# EAGLE design hexapod (EAGLE 5.91)
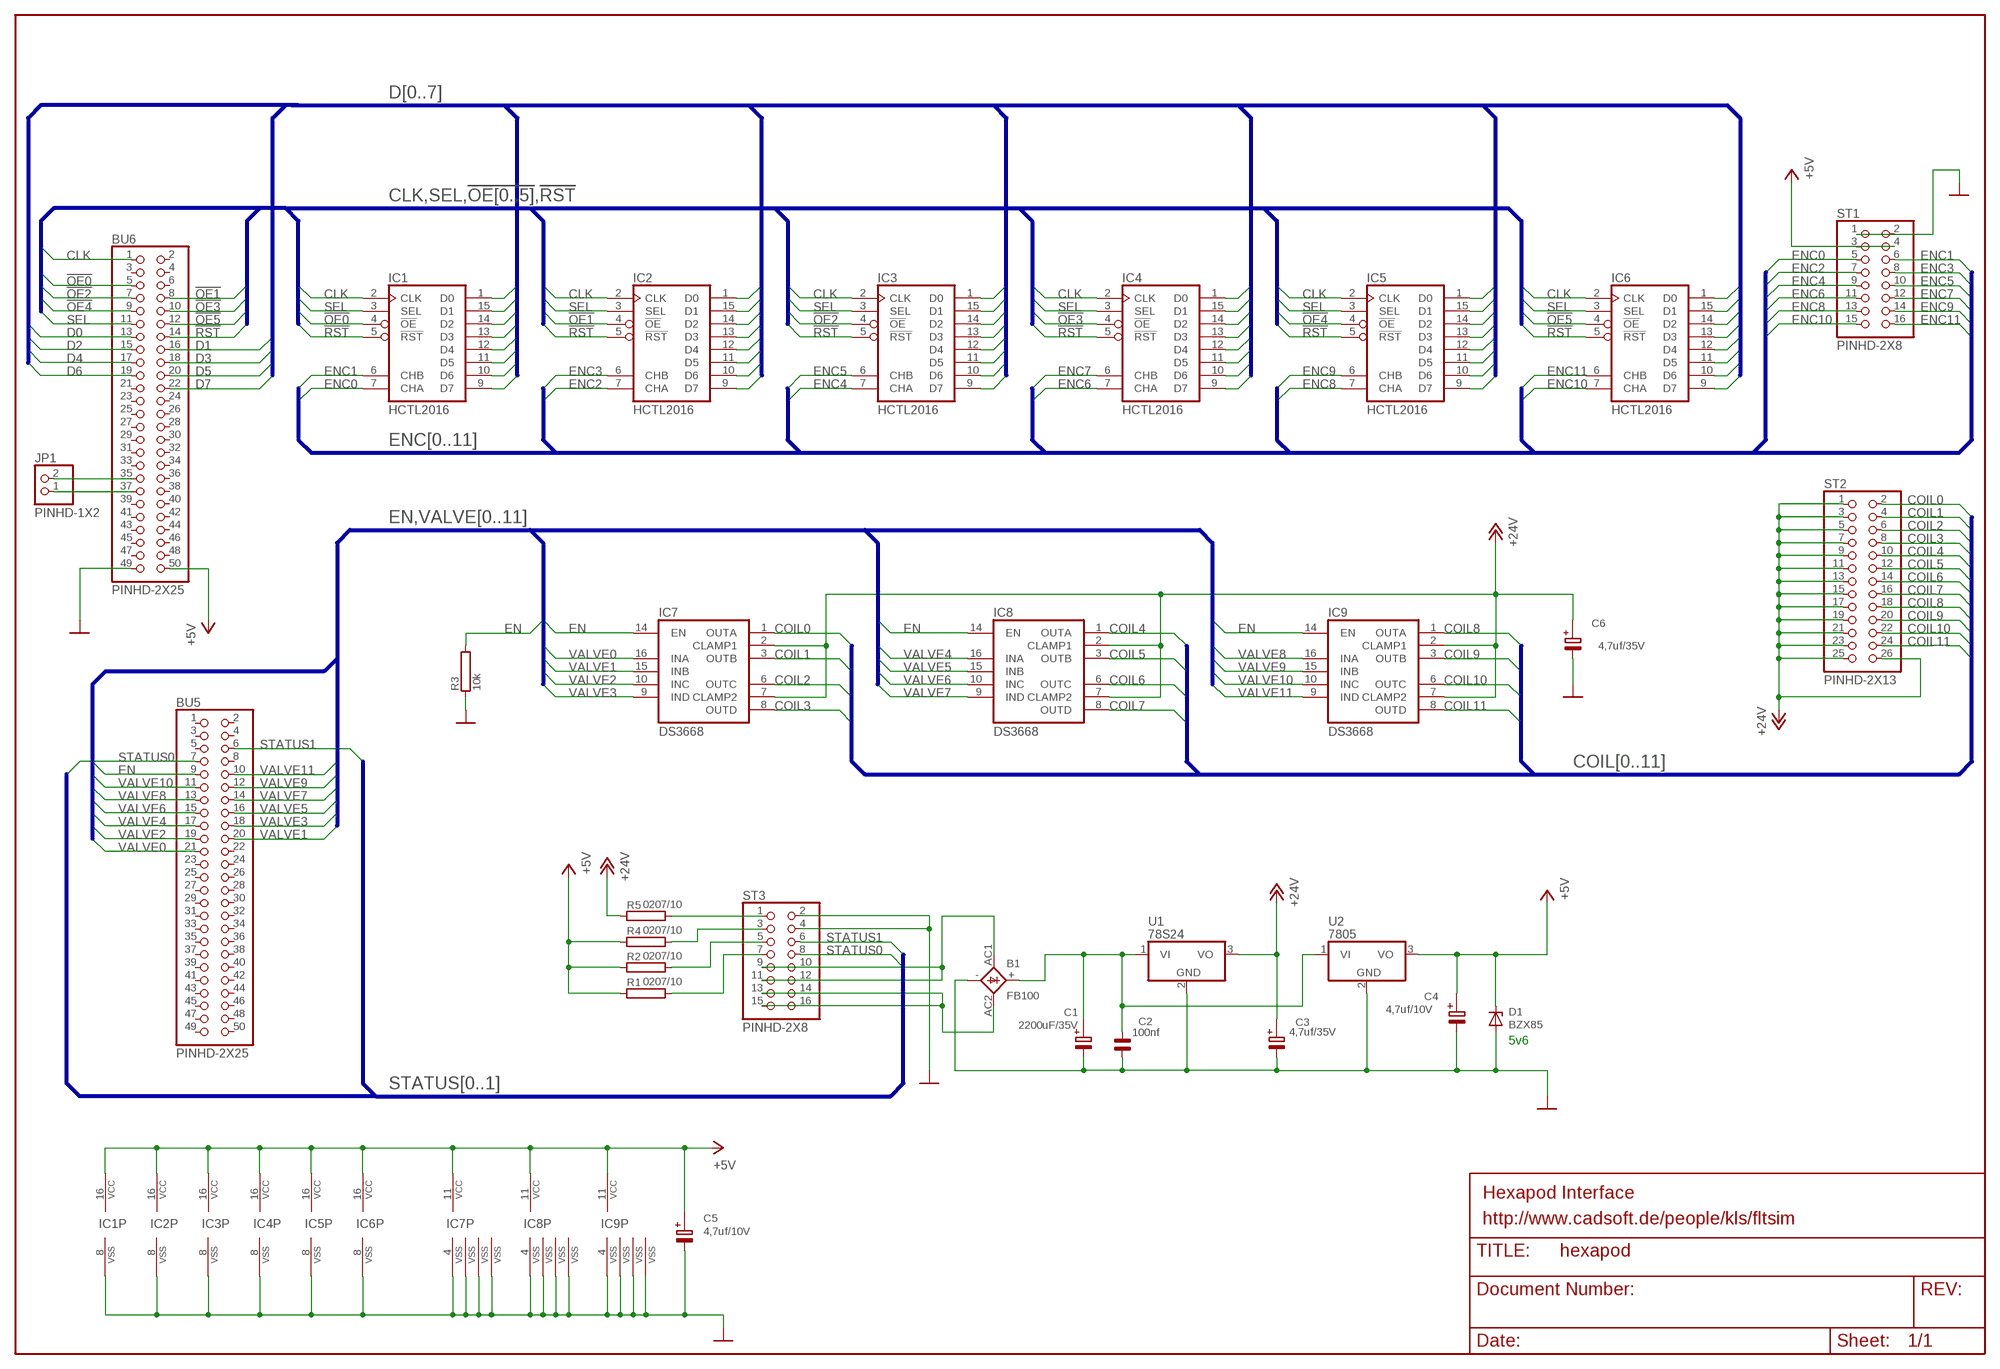
[diagram p0: schematic, sheet 1]

## Parts
B1  FB100  [FB100]
BU5  PINHD-2X25  [2X25]
BU6  PINHD-2X25  [2X25]
C1  2200uF/35V  E35-16  [E35-16]
C2  100nf  C5B2,5A  [C5B2,5A]
C3  4,7uf/35V  E2-5@1  [E2,5-5]
C4  4,7uf/10V  E2,5-5  [E2,5-5]
C5  4,7uf/10V  E2,5-5  [E2,5-5]
C6  4,7uf/35V  E2-5@1  [E2,5-5]
D1  BZX85  [DO41Z10]
IC1  HCTL2016  [DIL-16]
IC2  HCTL2016  [DIL-16]
IC3  HCTL2016  [DIL-16]
IC4  HCTL2016  [DIL-16]
IC5  HCTL2016  [DIL-16]
IC6  HCTL2016  [DIL-16]
IC7  DS3668  [DIL-16]
IC8  DS3668  [DIL-16]
IC9  DS3668  [DIL-16]
JP1  PINHD-1X2  [1X02]
R1  0207/10  [0207/10]
R2  0207/10  [0207/10]
R3  10k  0207/10@1  [0207/10@1]
R4  0207/10  [0207/10]
R5  0207/10  [0207/10]
ST1  PINHD-2X8  PINHD-2X8@1  [ML16]
ST2  PINHD-2X13  PINHD-2X13@1  [ML26]
ST3  PINHD-2X8  PINHD-2X8@1  [ML16]
U1  78S24  78XXT  [TO220H]
U2  7805  78XXT  [TO220H]

## Nets
!OE0: BU6.5 IC1.4(!OE)
!OE1: BU6.8 IC2.4(!OE)
!OE2: BU6.7 IC3.4(!OE)
!OE3: BU6.10 IC4.4(!OE)
!OE4: BU6.9 IC5.4(!OE)
!OE5: BU6.12 IC6.4(!OE)
!RST: BU6.14 IC1.5(!RST) IC2.5(!RST) IC3.5(!RST) IC4.5(!RST) IC5.5(!RST) IC6.5(!RST)
+5V [supply]: BU6.50 C4.+ C5.+ D1.K IC1.16(VCC) IC2.16(VCC) IC3.16(VCC) IC4.16(VCC) IC5.16(VCC) IC6.16(VCC) IC7.11(VCC) IC8.11(VCC) IC9.11(VCC) R1.1 R2.1 R4.1 ST1.3 ST1.4 U2.3(VO)
+24V [supply]: C3.+ C6.+ IC7.2(CLAMP1) IC7.7(CLAMP2) IC8.2(CLAMP1) IC8.7(CLAMP2) IC9.2(CLAMP1) IC9.7(CLAMP2) R5.1 ST2.1 ST2.3 ST2.5 ST2.7 ST2.9 ST2.11 ST2.13 ST2.15 ST2.17 ST2.19 ST2.21 ST2.23 ST2.25 ST2.26 U1.3(VO)
AC1 [supply]: B1.AC1 ST3.9 ST3.10 ST3.11 ST3.12
AC2 [supply]: B1.AC2 ST3.13 ST3.14 ST3.15 ST3.16
CLK: BU6.1 IC1.2(CLK) IC2.2(CLK) IC3.2(CLK) IC4.2(CLK) IC5.2(CLK) IC6.2(CLK)
COIL0: IC7.1(OUTA) ST2.2
COIL1: IC7.3(OUTB) ST2.4
COIL2: IC7.6(OUTC) ST2.6
COIL3: IC7.8(OUTD) ST2.8
COIL4: IC8.1(OUTA) ST2.10
COIL5: IC8.3(OUTB) ST2.12
COIL6: IC8.6(OUTC) ST2.14
COIL7: IC8.8(OUTD) ST2.16
COIL8: IC9.1(OUTA) ST2.18
COIL9: IC9.3(OUTB) ST2.20
COIL10: IC9.6(OUTC) ST2.22
COIL11: IC9.8(OUTD) ST2.24
D0: BU6.13 IC1.1(D0) IC2.1(D0) IC3.1(D0) IC4.1(D0) IC5.1(D0) IC6.1(D0)
D1: BU6.16 IC1.15(D1) IC2.15(D1) IC3.15(D1) IC4.15(D1) IC5.15(D1) IC6.15(D1)
D2: BU6.15 IC1.14(D2) IC2.14(D2) IC3.14(D2) IC4.14(D2) IC5.14(D2) IC6.14(D2)
D3: BU6.18 IC1.13(D3) IC2.13(D3) IC3.13(D3) IC4.13(D3) IC5.13(D3) IC6.13(D3)
D4: BU6.17 IC1.12(D4) IC2.12(D4) IC3.12(D4) IC4.12(D4) IC5.12(D4) IC6.12(D4)
D5: BU6.20 IC1.11(D5) IC2.11(D5) IC3.11(D5) IC4.11(D5) IC5.11(D5) IC6.11(D5)
D6: BU6.19 IC1.10(D6) IC2.10(D6) IC3.10(D6) IC4.10(D6) IC5.10(D6) IC6.10(D6)
D7: BU6.22 IC1.9(D7) IC2.9(D7) IC3.9(D7) IC4.9(D7) IC5.9(D7) IC6.9(D7)
EN: BU5.9 IC7.14(EN) IC8.14(EN) IC9.14(EN) R3.2
ENC0: IC1.7(CHA) ST1.5
ENC1: IC1.6(CHB) ST1.6
ENC2: IC2.7(CHA) ST1.7
ENC3: IC2.6(CHB) ST1.8
ENC4: IC3.7(CHA) ST1.9
ENC5: IC3.6(CHB) ST1.10
ENC6: IC4.7(CHA) ST1.11
ENC7: IC4.6(CHB) ST1.12
ENC8: IC5.7(CHA) ST1.13
ENC9: IC5.6(CHB) ST1.14
ENC10: IC6.7(CHA) ST1.15
ENC11: IC6.6(CHB) ST1.16
GND [supply]: B1.- BU6.49 C1.- C2.1 C3.- C4.- C5.- C6.- D1.A IC1.8(VSS) IC2.8(VSS) IC3.8(VSS) IC4.8(VSS) IC5.8(VSS) IC6.8(VSS) IC7.4(VSS) IC7.5(VSS) IC7.12(VSS) IC7.13(VSS) IC8.4(VSS) IC8.5(VSS) IC8.12(VSS) IC8.13(VSS) IC9.4(VSS) IC9.5(VSS) IC9.12(VSS) IC9.13(VSS) R3.1 ST1.1 ST1.2 ST3.2 ST3.4 U1.2(GND) U2.2(GND)
N$4: R5.2 ST3.1
N$5: R4.2 ST3.3
N$6: R2.2 ST3.5
N$7: R1.2 ST3.7
N$8: BU6.35 JP1.2
N$9: BU6.37 JP1.1
SEL: BU6.11 IC1.3(SEL) IC2.3(SEL) IC3.3(SEL) IC4.3(SEL) IC5.3(SEL) IC6.3(SEL)
STATUS0: BU5.7 ST3.8
STATUS1: BU5.6 ST3.6
VALVE0: BU5.21 IC7.16(INA)
VALVE1: BU5.20 IC7.15(INB)
VALVE2: BU5.19 IC7.10(INC)
VALVE3: BU5.18 IC7.9(IND)
VALVE4: BU5.17 IC8.16(INA)
VALVE5: BU5.16 IC8.15(INB)
VALVE6: BU5.15 IC8.10(INC)
VALVE7: BU5.14 IC8.9(IND)
VALVE8: BU5.13 IC9.16(INA)
VALVE9: BU5.12 IC9.15(INB)
VALVE10: BU5.11 IC9.10(INC)
VALVE11: BU5.10 IC9.9(IND)
VIN [supply]: B1.+ C1.+ C2.2 U1.1(VI) U2.1(VI)
Unconnected: BU5.1 BU5.2 BU5.3 BU5.4 BU5.5 BU5.8 BU5.22 BU5.23 BU5.24 BU5.25 BU5.26 BU5.27 BU5.28 BU5.29 BU5.30 BU5.31 BU5.32 BU5.33 BU5.34 BU5.35 BU5.36 BU5.37 BU5.38 BU5.39 BU5.40 BU5.41 BU5.42 BU5.43 BU5.44 BU5.45 BU5.46 BU5.47 BU5.48 BU5.49 BU5.50 BU6.2 BU6.3 BU6.4 BU6.6 BU6.21 BU6.23 BU6.24 BU6.25 BU6.26 BU6.27 BU6.28 BU6.29 BU6.30 BU6.31 BU6.32 BU6.33 BU6.34 BU6.36 BU6.38 BU6.39 BU6.40 BU6.41 BU6.42 BU6.43 BU6.44 BU6.45 BU6.46 BU6.47 BU6.48

## Buses
D[0..7]
CLK,SEL,!OE[0..5],!RST
ENC[0..11]
EN,VALVE[0..11]
COIL[0..11]
STATUS[0..1]

## Notes on the sheet
- 5v6
- Hexapod Interface
- http://www.cadsoft.de/people/kls/fltsim

## Library data of the parts
B1 = RECTIF:FB100
BU5 BU6 = PINHEAD:PINHD-2X25
C1 = ELKO:E35-16
C2 = CAP-WI:C5B2,5A
C3 C6 = ELKO:E2-5@1
C4 C5 = ELKO:E2,5-5
D1 = diode:BZX85
IC1-IC6 = klaus:HCTL2016
IC7-IC9 = klaus:DS3668
JP1 = PINHEAD:PINHD-1X2
R1 R2 R4 R5 = R:0207/10
R3 = R:0207/10@1
ST1 ST3 = PINHEAD:PINHD-2X8@1
ST2 = PINHEAD:PINHD-2X13@1
U1 U2 = LINEAR:78XXT

## Net classes
0 default: width 0.406 mm
1 supply: width 1.143 mm

## Board
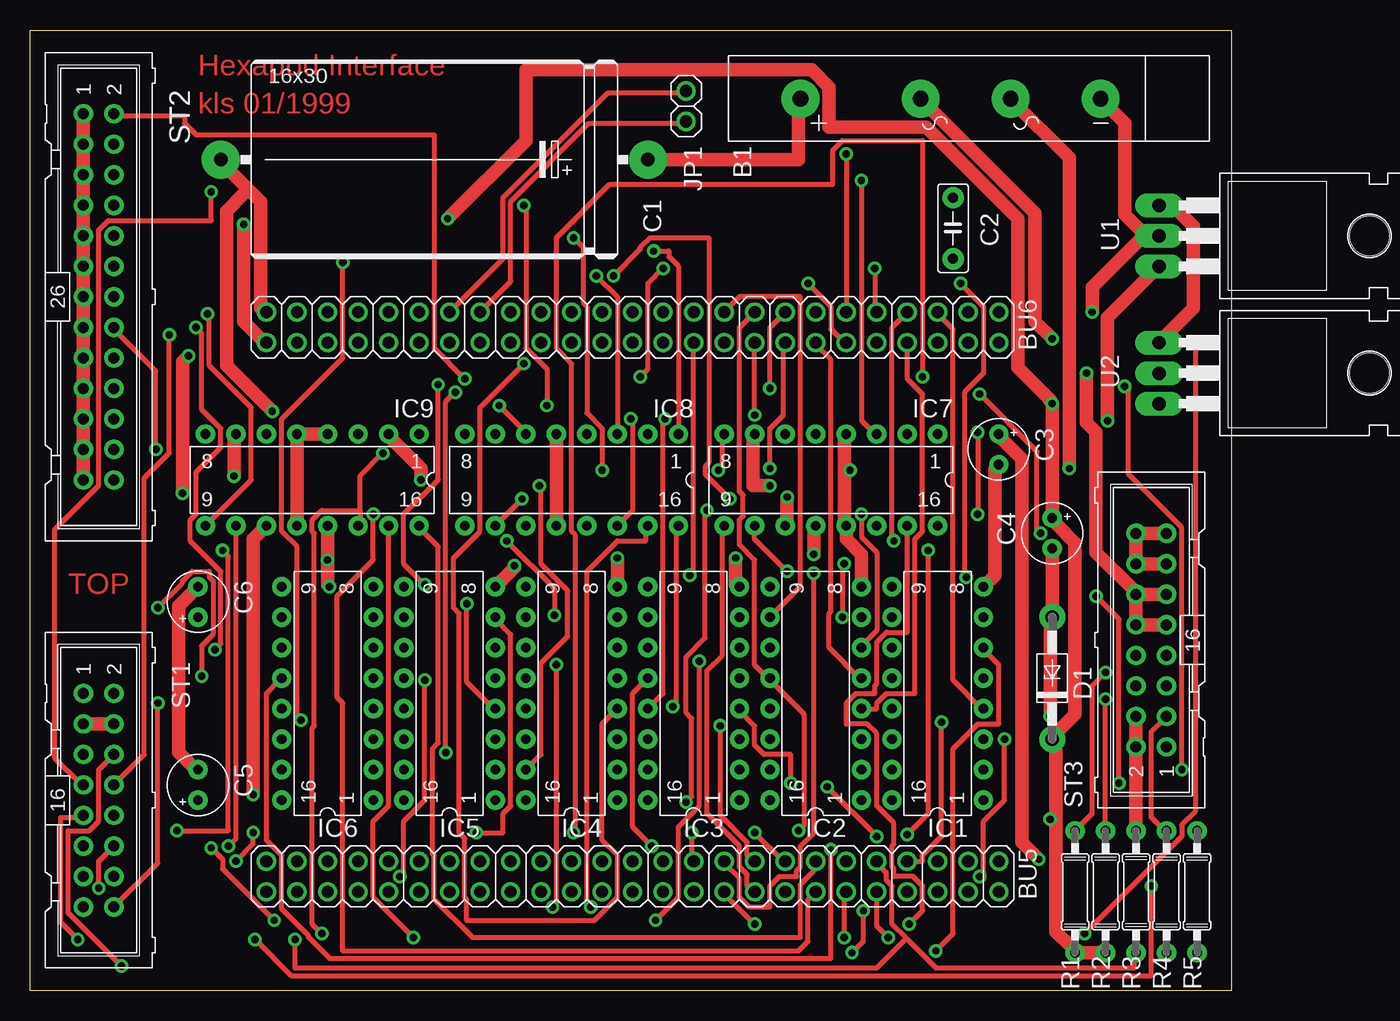
[diagram p1: board, top side]
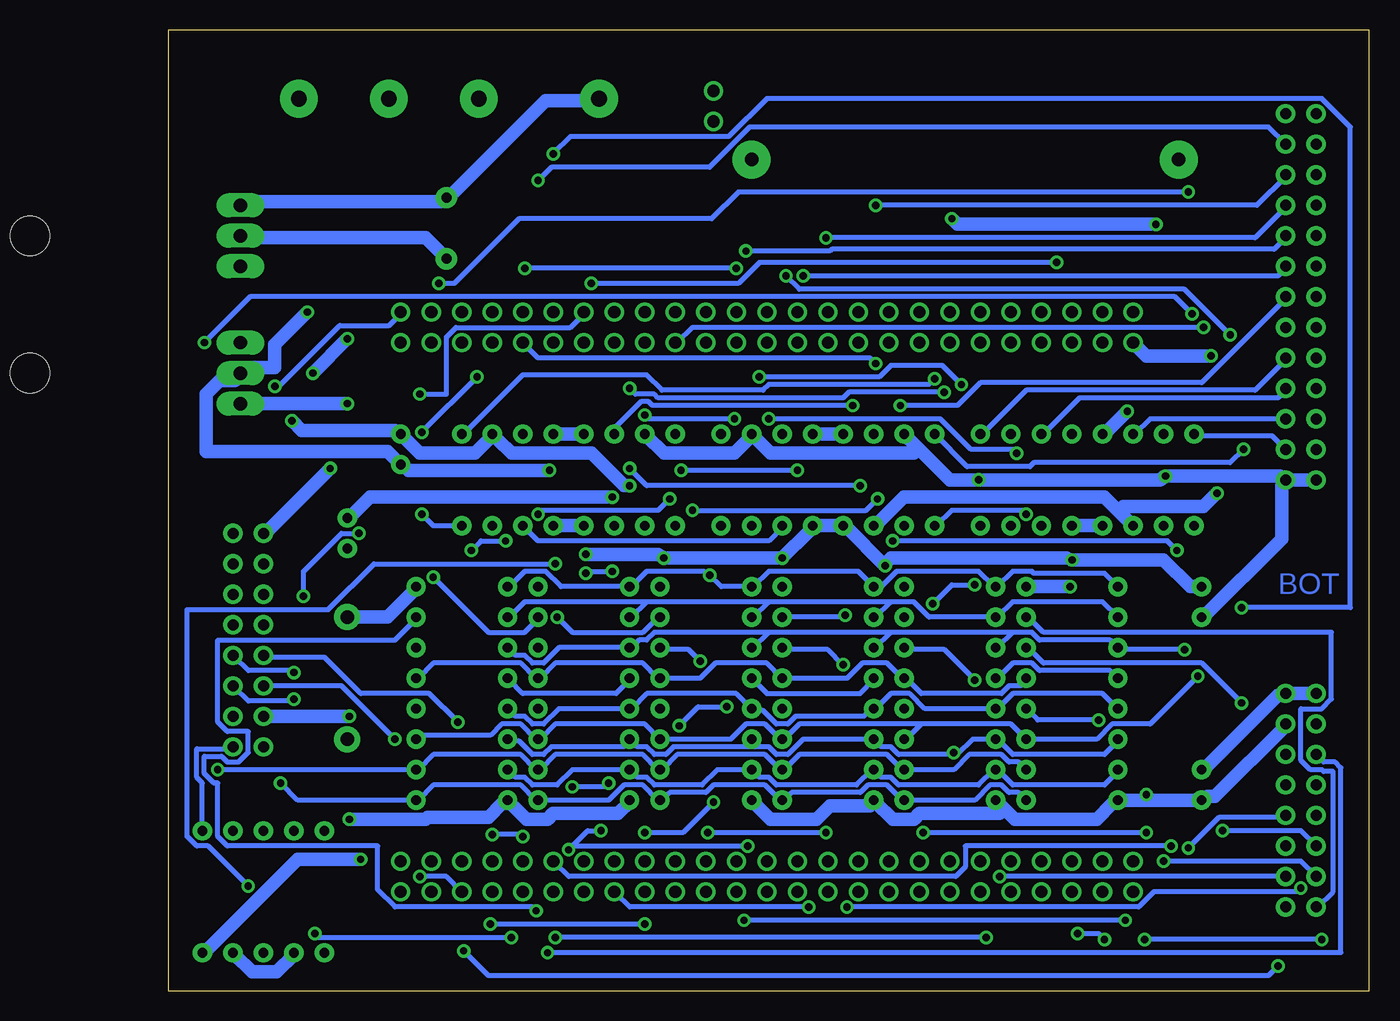
[diagram p2: board, bottom side, seen from below]

Size 100 x 80 mm. Coordinates in mm from the lower left corner, seen from the top.
Outline: 0,0 0,80 100,80 100,0 0,0
Copper layers (1*16): Top 0.035mm / dielectric 1.5mm / Bottom 0.035mm
Design rules: minimum track width 10mil, minimum drill 24mil, track to track 8mil, track to pad 8mil, pad to pad 8mil, via to via 8mil, smd to smd 8mil, copper to edge 40mil, drill to drill 8mil, minimum pad ring 10mil, minimum via ring 10mil, stop-mask expansion 0mil, vias tented up to drill 0mil, thermal gap 10mil

### Footprints (pad centres in the part's own frame; a part is rotated, then mirrored left to right if it is on the bottom)
FB100 = drill 1.321 pad 3.15: + 0,0; - 24.994,0; AC1 10.008,0; AC2 17.501,0
2X25 = drill 1.016 pad 1.6: 1 -30.48,-1.27; 2 -30.48,1.27; 3 -27.94,-1.27; 4 -27.94,1.27; 5 -25.4,-1.27; 6 -25.4,1.27; 7 -22.86,-1.27; 8 -22.86,1.27; 9 -20.32,-1.27; 10 -20.32,1.27; 11 -17.78,-1.27; 12 -17.78,1.27; 13 -15.24,-1.27; 14 -15.24,1.27; 15 -12.7,-1.27; 16 -12.7,1.27; 17 -10.16,-1.27; 18 -10.16,1.27; 19 -7.62,-1.27; 20 -7.62,1.27; 21 -5.08,-1.27; 22 -5.08,1.27; 23 -2.54,-1.27; 24 -2.54,1.27; 25 0,-1.27; 26 0,1.27; 27 2.54,-1.27; 28 2.54,1.27; 29 5.08,-1.27; 30 5.08,1.27; 31 7.62,-1.27; 32 7.62,1.27; 33 10.16,-1.27; 34 10.16,1.27; 35 12.7,-1.27; 36 12.7,1.27; 37 15.24,-1.27; 38 15.24,1.27; 39 17.78,-1.27; 40 17.78,1.27; 41 20.32,-1.27; 42 20.32,1.27; 43 22.86,-1.27; 44 22.86,1.27; 45 25.4,-1.27; 46 25.4,1.27; 47 27.94,-1.27; 48 27.94,1.27; 49 30.48,-1.27; 50 30.48,1.27
E35-16 = drill 1.118 pad 3.15: + -17.78,0; - 17.78,0
C5B2,5A = drill 0.813 pad 1.778: 1 -2.54,0; 2 2.54,0
E2,5-5 = drill 0.813 pad 1.6: + -1.27,0; - 1.27,0
DO41Z10 = drill 1.118 pad 2.159: A 5.08,0; K -5.08,0
DIL-16 = drill 0.813 pad 1.6: 1 -8.89,-3.81; 2 -6.35,-3.81; 3 -3.81,-3.81; 4 -1.27,-3.81; 5 1.27,-3.81; 6 3.81,-3.81; 7 6.35,-3.81; 8 8.89,-3.81; 9 8.89,3.81; 10 6.35,3.81; 11 3.81,3.81; 12 1.27,3.81; 13 -1.27,3.81; 14 -3.81,3.81; 15 -6.35,3.81; 16 -8.89,3.81
1X02 = drill 1.016 pad 1.6: 1 -1.27,0; 2 1.27,0
0207/10 = drill 0.813 pad 1.6: 1 -5.08,0; 2 5.08,0
0207/10@1 = drill 0.813 pad 1.6: 1 -5.08,0; 2 5.08,0
ML16 = drill 0.914 pad 1.6: 1 -8.89,-1.27; 2 -8.89,1.27; 3 -6.35,-1.27; 4 -6.35,1.27; 5 -3.81,-1.27; 6 -3.81,1.27; 7 -1.27,-1.27; 8 -1.27,1.27; 9 1.27,-1.27; 10 1.27,1.27; 11 3.81,-1.27; 12 3.81,1.27; 13 6.35,-1.27; 14 6.35,1.27; 15 8.89,-1.27; 16 8.89,1.27
ML26 = drill 0.914 pad 1.6: 1 -15.24,-1.27; 2 -15.24,1.27; 3 -12.7,-1.27; 4 -12.7,1.27; 5 -10.16,-1.27; 6 -10.16,1.27; 7 -7.62,-1.27; 8 -7.62,1.27; 9 -5.08,-1.27; 10 -5.08,1.27; 11 -2.54,-1.27; 12 -2.54,1.27; 13 0,-1.27; 14 0,1.27; 15 2.54,-1.27; 16 2.54,1.27; 17 5.08,-1.27; 18 5.08,1.27; 19 7.62,-1.27; 20 7.62,1.27; 21 10.16,-1.27; 22 10.16,1.27; 23 12.7,-1.27; 24 12.7,1.27; 25 15.24,-1.27; 26 15.24,1.27
TO220H = drill 1.118 pad 2 long: 1 -2.54,-6.35; 2 0,-6.35; 3 2.54,-6.35 | hole 3.302: 0,11.176

### Placement (x,y rotation side)
B1  64.14,74.3 0 top
BU5  50.16,9.53 180 top
BU6  50.16,55.24 180 top
C1  33.66,69.22 180 top
C2  76.83,63.5 90 top
C3  80.64,45.09 270 top
C4  85.09,38.1 270 top
C5  13.97,17.14 90 top
C6  13.97,32.38 90 top
D1  85.09,26.04 90 top
IC1  75.56,24.77 90 top
IC2  65.41,24.77 90 top
IC3  55.24,24.77 90 top
IC4  45.09,24.77 90 top
IC5  34.92,24.77 90 top
IC6  24.77,24.77 90 top
IC7  66.67,42.55 180 top
IC8  45.09,42.55 180 top
IC9  23.5,42.55 180 top
JP1  54.61,73.66 270 top
R1  87,8.26 90 top
R2  89.53,8.26 90 top
R3  92.08,8.26 270 top
R4  94.61,8.26 90 top
R5  97.16,8.26 90 top
ST1  5.71,15.88 270 top
ST2  5.71,57.78 270 top
ST3  93.34,29.21 90 top
U1  100.33,62.87 270 top
U2  100.33,51.44 270 top

### Tracks (layer width: path | path; a pad name or v marks a point on that pad's centre or on a via)
!OE0
  Top 0.406: IC1.4 79.22,23.5 76.83,25.88 76.83,55.09 75.56,56.36 BU6.5
!OE1
  Top 0.406: IC2.4 70.48,23.5 70.48,23.97 71.28,24.77 73.66,24.77 73.66,37.62 74.3,38.26 74.3,49.69 73.03,50.96 BU6.8 | IC2.4
!OE2  (via drill 0.61)
  Top 0.406: v63.34,17.3 63.34,19.68 61.12,19.68 60.33,20.48 60.33,22.07 59.05,23.34 IC3.4 | v66.36,16.99 v70.48,12.86 | v73.03,13.02 74.77,14.76 v74.77,36.67 | v71.91,37.47 71.75,37.62 71.75,55.24 72.87,56.36 BU6.7
  Bottom 0.406: v63.34,17.3 63.66,16.99 v66.36,16.99 | v70.48,12.86 70.64,13.02 v73.03,13.02 | v74.77,36.67 73.98,37.47 v71.91,37.47
!OE3  (via drill 0.61)
  Top 0.406: v41.12,52.23 37.47,48.58 37.47,38.26 35.24,36.04 35.24,31.91 35.72,31.43 35.72,13.18 36.2,12.7 36.2,7.78 36.35,7.62 36.35,5.87 46.99,5.87 48.9,7.78 48.9,11.27 47.62,12.54 47.62,22.23 48.74,23.34 IC4.4
  Bottom 0.406: v41.12,52.23 41.59,52.7 69.22,52.7 70.33,53.82 BU6.10
!OE4  (via drill 0.61)
  Top 0.406: v36.35,32.23 36.35,25.72 38.58,23.5 IC5.4 | v32.86,33.81 31.11,35.56 31.11,39.69 33.97,42.55 v33.97,50.48 | v50.8,51.12 51.44,51.75 51.44,58.9 v52.7,60.17 | v70.33,60.17 70.33,56.52 BU6.9
  Bottom 0.406: v36.35,32.23 34.77,33.81 v32.86,33.81 | v33.97,50.48 35.56,52.07 39.85,52.07 40.8,51.12 v50.8,51.12 | v52.7,60.17 v70.33,60.17
!OE5  (via drill 0.61)
  Top 0.406: v22.54,22.54 22.23,22.86 22.23,36.99 20.95,38.26 20.95,47.62 26.04,52.7 v26.04,60.64 | v64.77,58.9 66.67,56.99 66.67,55.09 67.79,53.98 BU6.12
  Bottom 0.406: v22.54,22.54 27.62,22.54 28.42,23.34 IC6.4 | v26.04,60.64 50.8,60.64 52.55,58.9 v64.77,58.9
!RST
  Top 0.406: BU6.14 65.41,53.82 66.67,52.55 66.67,31.59 66.52,31.43 66.52,28.57 69.06,26.04 IC2.5
  Bottom 0.406: IC6.5 28.57,25.88 29.05,25.4 30,25.4 30.64,24.77 37.31,24.77 38.42,25.88 38.58,25.88 IC5.5 38.89,26.04 40.16,27.3 42.23,27.3 43.5,26.04 48.74,26.04 IC4.5 | IC4.5 50.16,27.3 54.45,27.3 55.72,26.04 58.9,26.04 IC3.5 59.21,26.04 60.48,27.3 67.79,27.3 69.06,26.04 IC2.5 69.37,26.04 70.64,27.3 77.95,27.3 79.22,26.04 IC1.5 | IC4.5
+5V  (via drill 0.61)
  Top 1.143: IC7.11 63.02,38.89 v63.02,41.12 | IC7.11 | C4.+ v85.09,48.9 84.77,49.37 82.23,51.91 82.23,64.29 74.61,71.91 66.52,71.91 66.52,75.25 65.09,76.68 41.27,76.68 41.27,70.8 v34.77,64.29 | C4.+ | R1.1 89.38,3.17 R2.1 | R1.1 | 85.41,14.29 85.41,4.92 86.68,3.65 R1.1 | 85.41,14.29 85.41,20.48 85.09,20.8 D1.K 85.41,21.43 87,23.02 87,37.31 85.41,38.89 C4.+ | 85.41,14.29 v84.93,14.29 | v13.18,52.86 12.7,52.39 v12.7,41.43 | ST1.3 6.83,22.23 ST1.4 | ST1.3 | v18.57,16.35 18.57,37.62 IC9.11 | v17.78,63.82 17.78,55.72 19.53,53.98 BU6.50
  Bottom 1.143: v63.02,41.12 83.19,41.12 84.93,39.37 C4.+ | v85.09,48.9 93.82,48.9 U2.3 | IC2.16 61.59,15.72 62.55,14.76 67.94,14.76 68.42,14.29 70.17,14.29 71.6,15.72 IC1.16 72.23,15.56 73.34,14.45 78.42,14.45 78.58,14.29 v84.93,14.29 | R4.1 94.46,3.02 93.03,1.59 90.96,1.59 89.53,3.02 R2.1 | 20.88,39.93 22.07,41.12 38.73,41.12 41.12,38.73 IC8.11 | IC9.11 20.88,39.93 | IC9.11 | v13.18,52.86 18.57,52.86 BU6.50 | v12.7,41.43 13.81,40.32 20.48,40.32 20.88,39.93 | 18.57,15.88 20.8,15.88 IC6.16 21.43,15.56 22.7,14.29 29.53,14.29 30.4,15.16 | C5.+ 18.57,15.88 | C5.+ | 30.4,15.16 IC5.16 | 30.4,15.16 30.8,14.76 37.47,14.76 37.94,14.29 39.69,14.29 41.12,15.72 IC4.16 41.59,15.4 44.93,15.4 46.04,14.29 49.85,14.29 51.28,15.72 IC3.16 | ST1.4 6.99,22.07 12.86,16.19 13.49,16.19 C5.+ | 18.57,15.88 v18.57,16.35 | v34.77,64.29 34.29,63.82 v17.78,63.82
+24V  (via drill 0.61)
  Top 1.143: v83.98,10.95 82.55,12.38 82.55,44.29 80.64,46.2 C3.+ | v89.69,47.47 89.69,56.04 U1.3 | v32.54,42.55 32.54,43.5 29.84,46.2 IC9.2 | ST2.25 | ST2.25 ST2.23 ST2.21 ST2.19 ST2.17 ST2.15 ST2.13 ST2.11 ST2.9 ST2.7 ST2.5 ST2.3 ST2.1 | v16.99,42.86 16.99,46.2 IC9.7 | v61.59,42.07 60.17,42.07 60.17,46.2 IC7.7
  Bottom 1.143: v83.98,10.95 89.22,10.95 97,3.17 R5.1 | v89.69,47.47 88.9,46.67 81.12,46.67 C3.+ 80.49,46.2 79.06,44.77 74.45,44.77 73.03,46.2 IC7.2 72.55,45.88 71.44,44.77 64.77,44.77 62.07,42.07 v61.59,42.07 | IC7.7 60.17,46.2 58.74,44.77 52.86,44.77 51.44,46.2 IC8.2 50.96,45.88 49.85,44.77 37.94,44.77 37.54,45.16 | 37.54,45.16 34.92,42.55 v32.54,42.55 17.46,42.55 v16.99,42.86 7.46,42.86 ST2.26 | 37.54,45.16 IC8.7 | ST2.25 6.83,42.55 ST2.26 | ST2.25 | C6.+ 13.81,31.11 7.3,37.62 7.3,42.07 ST2.26
AC1  (via drill 0.61)
  Top 1.143: ST3.10 | ST3.10 ST3.12 | ST3.9 94.46,30.48 92.55,30.48 ST3.10 | ST3.11 94.46,33.02 92.55,33.02 ST3.12 | v87.95,51.44 87.95,47.31 88.74,46.51 88.74,36.51 91.76,33.5 ST3.12 | v85.09,54.29 83.66,55.72 83.66,64.77 74.3,74.14 B1.AC1
  Bottom 1.143: v87.95,51.44 v85.09,54.29
AC2  (via drill 0.61)
  Top 1.143: ST3.14 | ST3.14 ST3.16 92.55,38.1 94.46,38.1 ST3.15 | ST3.13 94.46,35.56 92.55,35.56 ST3.14 | v86.52,43.5 86.52,69.37 81.76,74.14 B1.AC2
  Bottom 1.143: v86.52,43.5 91.92,38.1 ST3.16
CLK  (via drill 0.61)
  Top 0.406: v91.12,50.32 91.44,50.01 91.44,43.02 95.89,38.58 v95.89,18.41
  Bottom 0.406: IC6.2 29.21,19.05 30,19.05 30.64,19.68 33.34,19.68 34.61,18.41 38.58,18.41 IC5.2 38.89,18.41 40.16,19.68 47.47,19.68 48.74,18.41 IC4.2 49.05,18.41 50.32,19.68 57.63,19.68 58.9,18.41 IC3.2 59.21,18.41 60.48,19.68 67.79,19.68 69.06,18.41 IC2.2 69.37,18.41 70.64,19.68 77.95,19.68 79.22,18.41 IC1.2 79.53,18.41 v95.89,18.41 | IC6.2 | v91.12,50.32 90.81,50.32 85.72,55.4 81.6,55.4 80.64,56.36 BU6.1
COIL0  (via drill 0.61)
  Top 0.406: v36.2,50.96 33.66,53.5 33.66,71.28 13.81,71.28 12.86,72.23 12.86,72.87 6.99,72.87 ST2.2
  Bottom 0.406: v36.2,50.96 36.67,50.48 50.01,50.48 50.48,50.01 58.9,50.01 60.17,51.28 70.48,51.28 75.41,46.35 IC7.1
COIL1  (via drill 0.61)
  Top 0.406: v69.22,67.47 69.22,47.47 70.33,46.35 IC7.3
  Bottom 0.406: v69.22,67.47 68.1,68.58 54.93,68.58 51.59,71.91 8.41,71.91 ST2.4 | ST2.4
COIL2  (via drill 0.61)
  Top 0.406: v41.12,65.41 41.27,65.25 41.27,53.5 43.02,51.75 v43.02,48.74
  Bottom 0.406: v41.12,65.41 9.37,65.41 6.99,67.79 ST2.6 | v43.02,48.74 59.69,48.74 60.01,49.05 60.64,49.05 62.71,46.99 62.71,46.35 IC7.6
COIL3  (via drill 0.61)
  Top 0.406: v45.24,62.71 46.04,61.91 46.04,57.31 46.35,56.99 46.35,48.1 47.62,46.83 v47.62,43.34 | v57.31,43.34 57.63,43.66 57.63,46.2 IC7.8
  Bottom 0.406: v45.24,62.71 9.53,62.71 6.99,65.25 ST2.8 | v47.62,43.34 v57.31,43.34
COIL4  (via drill 0.61)
  Top 0.406: v51.91,61.59 53.18,61.59 53.18,61.12 53.98,60.33 IC8.1 | IC8.1
  Bottom 0.406: v51.91,61.59 44.93,61.59 44.77,61.75 7.94,61.75 6.99,62.71 ST2.10
COIL5  (via drill 0.61)
  Top 0.406: v47.15,59.53 48.9,57.78 IC8.3 | IC8.3
  Bottom 0.406: v47.15,59.53 7.62,59.53 6.99,60.17 ST2.12
COIL6  (via drill 0.61)
  Top 0.406: v39.05,48.74 41.12,46.67 41.12,46.35 IC8.6
  Bottom 0.406: v39.05,48.74 34.29,48.74 32.38,50.64 13.97,50.64 6.99,57.63 ST2.14
COIL7  (via drill 0.61)
  Top 0.406: v10.48,45.09 10.48,51.59 6.99,55.09 ST2.16
  Bottom 0.406: v10.48,45.09 11.59,43.97 27.94,43.97 28.26,43.66 33.5,43.66 IC8.8
COIL8
  Bottom 0.406: ST2.18 6.99,52.55 9.53,50.01 28.57,50.01 32.23,46.35 IC9.1
COIL9
  Bottom 0.406: ST2.20 6.99,50.01 7.62,49.37 24.13,49.37 27.15,46.35 IC9.3
COIL10
  Bottom 0.406: ST2.22 18.26,47.62 19.53,46.35 IC9.6 | ST2.22
COIL11
  Bottom 0.406: ST2.24 8.1,46.2 14.45,46.2 IC9.8 | ST2.24
D0  (via drill 0.61)
  Top 0.406: v79.06,49.69 83.82,44.93 83.82,38.42 v84.14,38.1 | v88.74,32.86 90.65,30.96 v90.65,17.3
  Bottom 0.406: IC6.1 29.21,16.51 30,16.51 30.64,17.14 31.59,17.14 32.86,15.88 38.58,15.88 IC5.1 38.89,15.88 40.16,17.14 41.75,17.14 42.39,16.51 48.1,16.51 48.74,15.88 IC4.1 49.05,15.88 50.32,17.14 54.61,17.14 55.24,16.51 58.26,16.51 58.9,15.88 IC3.1 59.21,15.88 60.48,17.14 62.07,17.14 63.34,15.88 69.06,15.88 IC2.1 69.37,15.88 70.64,17.14 77.95,17.14 79.22,15.88 IC1.1 79.53,15.88 89.22,15.88 v90.65,17.3 | IC6.1 | v79.06,49.69 76.83,49.69 76.83,54.45 76.04,55.24 66.52,55.24 65.41,56.36 BU6.13 | v84.14,38.1 85.57,38.1 88.74,34.92 v88.74,32.86
D1  (via drill 0.61)
  Top 0.406: v61.59,43.5 61.59,46.83 62.71,47.94 62.71,53.82 BU6.16 | v42.39,42.07 42.55,41.91 42.55,35.56 44.77,33.34 44.77,29.53 42.55,27.3 42.55,19.68 IC4.15 | IC4.15
  Bottom 0.406: IC6.15 20.95,18.26 22.07,17.14 29.69,17.14 30.8,18.26 30.96,18.26 IC5.15 31.27,18.41 32.54,17.14 39.21,17.14 39.85,17.78 40.64,17.78 41.12,18.26 IC4.15 41.43,18.41 42.7,17.14 49.37,17.14 50.01,17.78 50.8,17.78 51.28,18.26 IC3.15 51.59,18.41 54.29,18.41 55.56,17.14 59.53,17.14 60.17,17.78 60.96,17.78 61.44,18.26 IC2.15 61.75,18.41 66.36,18.41 67.63,17.14 69.69,17.14 70.33,17.78 71.12,17.78 71.6,18.26 IC1.15 | v61.59,43.5 60.17,42.07 v42.39,42.07
D2  (via drill 0.61)
  Top 0.406: v61.59,50.16 61.59,55.24 62.71,56.36 BU6.15 | v35.4,49.85 34.61,49.05 v34.61,19.84
  Bottom 0.406: IC1.14 71.6,20.8 70.8,20.8 69.69,19.68 68.74,19.68 68.1,20.32 62.07,20.32 61.59,20.8 IC2.14 61.44,20.8 60.96,20.32 60.17,20.32 59.53,19.68 58.58,19.68 57.94,20.32 50.96,20.32 IC3.14 51.28,20.8 50.8,20.32 50.01,20.32 49.37,19.68 48.42,19.68 47.15,20.95 41.43,20.95 IC4.14 41.12,20.8 40.64,20.32 39.85,20.32 39.21,19.68 34.61,19.68 | IC6.14 20.95,20.8 22.07,19.68 29.69,19.68 30.8,20.8 30.96,20.8 IC5.14 31.27,20.95 33.02,20.95 34.29,19.68 34.61,19.68 | v61.59,50.16 61.12,49.69 59.53,49.69 59.21,49.37 43.81,49.37 43.34,49.85 v35.4,49.85 | 34.61,19.68 v34.61,19.84
D3  (via drill 0.61)
  Top 0.406: v52.86,47.62 52.7,47.47 52.7,24.77 IC3.13 | v60.33,47.94 BU6.18 | IC3.13
  Bottom 0.406: IC6.13 22.23,24.77 29.69,24.77 30.96,23.5 IC5.13 31.27,23.5 36.99,23.5 38.26,24.77 39.85,24.77 41.12,23.5 IC4.13 41.43,23.5 42.07,22.86 47.78,22.86 48.42,22.23 49.37,22.23 50.48,23.34 51.28,23.34 IC3.13 | IC6.13 | IC3.13 52.7,24.77 60.17,24.77 61.44,23.5 IC2.13 61.75,23.5 67.47,23.5 68.74,22.23 69.69,22.23 70.33,22.86 71.12,22.86 71.6,23.34 IC1.13 | IC3.13 | v60.33,47.94 60.01,47.62 v52.86,47.62
D4  (via drill 0.61)
  Top 0.406: BU6.17 60.17,56.36 59.05,55.24 59.05,41.59 59.37,41.27 59.37,39.53 59.05,39.21 59.05,37.15 60.33,35.88 60.33,27.15 61.44,26.04 IC2.12 61.59,25.88 64.45,23.02 64.45,13.81 v63.98,13.34 | v66.67,11.75 66.67,2.7 24.92,2.7 23.18,4.45 23.18,4.6 20.95,6.83 20.95,11.27 19.68,12.54 19.68,24.77 20.8,25.88 IC6.12 | v51.75,12.06 50.16,13.65 50.16,24.77 51.28,25.88 IC3.12
  Bottom 0.406: IC4.12 41.27,25.88 42.39,24.77 50.16,24.77 51.28,25.88 IC3.12 | IC6.12 21.59,26.67 27.46,26.67 28.1,27.3 29.69,27.3 30.96,26.04 IC5.12 | IC6.12 | IC2.12 61.59,25.88 62.71,24.77 70.48,24.77 71.6,25.88 IC1.12 | 66.28,12.14 65.09,13.34 v63.98,13.34 | v66.67,11.75 66.28,12.14 | v51.75,12.06 66.2,12.06 66.28,12.14
D5  (via drill 0.61)
  Top 0.406: v13.81,55.24 14.29,54.77 14.29,48.42 15.88,46.83 15.88,45.24 13.81,43.18 13.81,39.69 13.34,39.21 13.34,37.47 15.88,34.92 15.88,28.89 v15.4,28.42
  Bottom 0.406: IC6.11 21.59,29.21 27.46,29.21 28.1,29.84 29.69,29.84 | 29.69,29.84 30.96,28.57 IC5.11 | IC6.11 | 39.93,29.77 39.85,29.84 29.69,29.84 | 39.93,29.77 41.12,28.57 IC4.11 | 50.09,29.77 50.01,29.84 40.01,29.84 39.93,29.77 | 50.09,29.77 51.28,28.57 IC3.11 | v13.81,55.24 56.36,55.24 57.63,53.98 BU6.20 | v15.4,28.42 20.8,28.42 IC6.11 | 50.09,29.77 50.16,29.84 59.53,29.84 60.17,29.21 60.8,29.21 61.44,28.57 IC2.11 61.75,28.57 67.47,28.57 68.74,27.3 69.69,27.3 70.33,27.94 71.12,27.94 71.6,28.42 IC1.11
D6
  Top 0.406: BU6.19 59.05,57.78 64.14,57.78 64.14,33.66 IC2.10 | BU6.19 | IC2.10
  Bottom 0.406: IC6.10 22.23,32.38 29.69,32.38 30.96,31.11 IC5.10 31.27,31.11 36.67,31.11 37.94,32.38 39.85,32.38 39.93,32.31 | IC6.10 | 39.93,32.31 41.12,31.11 IC4.10 | 50.09,32.31 50.01,32.38 40.01,32.38 39.93,32.31 | 50.09,32.31 51.28,31.11 IC3.10 | 60.25,32.31 60.17,32.38 50.16,32.38 50.09,32.31 | 60.25,32.31 61.44,31.11 IC2.10 | IC1.10 71.6,31.11 70.33,32.38 60.33,32.38 60.25,32.31
D7  (via drill 0.61)
  Top 0.406: v54.93,34.61 55.24,34.92 BU6.22
  Bottom 0.406: IC6.9 22.07,34.77 27.94,34.77 28.1,34.92 29.69,34.92 30.96,33.66 IC5.9 31.27,33.66 32.54,34.92 39.37,34.92 40.64,33.66 41.12,33.66 IC4.9 | IC6.9 | IC4.9 42.55,34.92 50.01,34.92 51.28,33.66 IC3.9 51.59,33.66 53.98,33.66 v54.93,34.61 55.09,34.61 55.4,34.92 60.17,34.92 61.44,33.66 IC2.9 61.75,33.66 67.31,33.66 68.58,34.92 70.33,34.92 71.6,33.66 IC1.9 | IC4.9
EN  (via drill 0.61)
  Top 0.406: 72.95,4.37 75.41,1.91 91.92,1.91 91.92,3.02 R3.2 | 72.95,4.37 71.75,5.56 71.75,8.73 71.28,9.21 71.28,9.84 70.48,10.64 BU5.9 | IC9.14 27.46,38.89 27.46,40.01 | 27.46,40.01 27.46,42.86 v29.37,44.77 | v50.01,47.62 50.16,47.47 50.16,40.01 IC8.14 | IC9.14 | IC8.14 | v22.07,4.29 22.07,1.91 70.48,1.91 72.87,4.29 72.95,4.37 | v24.29,4.76 23.5,5.56 23.5,21.91 23.65,22.07 23.65,38.1 23.5,38.26 23.5,39.21 24.29,40.01 27.46,40.01
  Bottom 0.406: v29.37,44.77 29.69,45.09 33.18,45.09 35.72,47.62 v50.01,47.62 | IC7.14 70.33,38.58 69.22,37.47 50.01,37.47 48.9,38.58 IC8.14 | v22.07,4.29 22.54,4.76 v24.29,4.76
ENC0  (via drill 0.61)
  Top 0.406: v68.42,3.17 69.37,4.13 v69.37,6.67
  Bottom 0.406: v68.42,3.17 2.38,3.17 2.38,18.57 2.86,19.05 3.81,19.05 4.29,19.53 ST1.5 | v69.37,6.67 69.69,6.99 81.12,6.99 82.55,8.41 82.55,12.06 95.09,12.06 95.89,12.86 95.89,17.3 96.2,17.3 97,18.1 97,19.53 95.57,19.53 95.09,19.05 94.14,19.05 93.34,19.84 93.34,21.59 95.09,21.59 95.89,22.38 95.89,29.21 81.12,29.21 79.38,30.96 IC1.7
ENC1  (via drill 0.61)
  Top 0.406: v7.62,2.06 3.17,6.51 3.17,13.34 4.92,13.34 5.71,14.13 5.71,18.41 6.83,19.53 ST1.6 | v75.41,3.33 76.83,4.76 76.83,20.16 78.9,22.23 80.64,22.23 80.64,27.15 79.38,28.42 IC1.6
  Bottom 0.406: v7.62,2.06 8.41,1.27 73.34,1.27 v75.41,3.33
ENC2  (via drill 0.61)
  Top 0.406: v15.08,66.52 15.08,64.14 6.51,64.14 5.71,63.34 5.71,42.07 2.06,38.42 2.06,19.37 4.29,17.14 ST1.7 | v77.47,58.9 79.38,56.99 79.38,51.44 77.79,49.85 77.79,34.61 v77.95,34.45
  Bottom 0.406: v15.08,66.52 52.55,66.52 54.77,64.29 70.8,64.29 76.2,58.9 v77.47,58.9 | v77.95,34.45 73.34,29.84 70.33,29.84 69.22,30.96 IC2.7
ENC3  (via drill 0.61)
  Top 0.406: ST1.8 9.53,19.68 9.53,42.7 11.59,44.77 v11.59,54.61 | v48.58,59.53 50.8,61.75 50.8,61.91 51.59,62.71 56.52,62.71 56.52,43.97 56.2,43.66 56.2,43.02 v58.26,40.96 | v69.22,39.69 69.22,37.78 70.48,36.51 70.48,30 69.22,28.73 IC2.6 | ST1.8 | IC2.6
  Bottom 0.406: v11.59,54.61 15.4,58.42 47.47,58.42 v48.58,59.53 | v58.26,40.96 59.21,40.01 68.9,40.01 v69.22,39.69
ENC4  (via drill 0.61)
  Top 0.406: v3.97,4.29 2.54,5.71 2.54,14.45 4.29,14.45 ST1.9 | v18.73,4.29 21.75,1.27 93.34,1.27 v93.34,8.73 | v67.79,35.56 67.63,35.4 v67.63,31.11
  Bottom 0.406: v3.97,4.29 v18.73,4.29 | v93.34,8.73 96.68,12.06 97.63,12.06 98.42,12.86 98.42,31.75 86.68,31.75 82.87,35.56 v67.79,35.56 | v67.63,31.11 66.36,29.84 60.48,29.84 59.37,30.96 59.05,30.96 IC3.7
ENC5  (via drill 0.61)
  Top 0.406: v15.08,11.91 16.03,10.95 16.03,10.16 v20.32,5.87 | v52.07,5.87 53.98,7.78 53.98,13.65 55.72,15.4 v55.72,27.46
  Bottom 0.406: v15.08,11.91 12.54,14.45 6.99,14.45 ST1.10 | v20.32,5.87 v52.07,5.87 | v55.72,27.46 56.67,28.42 58.9,28.42 IC3.6
ENC6  (via drill 0.61)
  Top 0.406: v12.22,13.34 16.51,13.34 16.51,36.2 v16.03,36.67 | v39.69,37.47 43.66,33.5 v43.66,31.27
  Bottom 0.406: ST1.11 5.71,13.34 v12.22,13.34 | v16.03,36.67 16.83,37.47 v39.69,37.47 | v43.66,31.27 43.81,31.11 48.74,31.11 IC4.7 | ST1.11
ENC7  (via drill 0.61)
  Top 0.406: v5.71,8.57 5.71,10.79 6.83,11.91 ST1.12 | v43.5,6.99 43.81,7.3 v43.81,27.15
  Bottom 0.406: v5.71,8.57 6.03,8.26 17.94,8.26 19.21,6.99 v43.5,6.99 | v43.81,27.15 45.09,28.42 48.74,28.42 IC4.6
ENC8  (via drill 0.61)
  Top 0.406: v17.14,10.79 18.57,12.22 v18.57,13.18 | v37.15,13.18 39.37,13.18 39.37,14.76 40.01,15.4 40.01,29.69 38.73,30.96 IC5.7
  Bottom 0.406: ST1.13 5.71,10.79 v17.14,10.79 | v18.57,13.18 v37.15,13.18 | ST1.13
ENC9  (via drill 0.61)
  Top 0.406: v30.8,9.53 31.11,9.84 31.11,14.13 32.86,15.88 v32.86,25.88
  Bottom 0.406: ST1.14 v30.8,9.53 | v32.86,25.88 35.4,28.42 38.58,28.42 IC5.6 | ST1.14
ENC10
  Bottom 0.406: ST1.15 4.29,6.99 3.02,8.26 3.02,18.26 3.81,18.26 3.97,18.41 4.92,18.41 5.71,19.21 5.71,23.5 3.97,23.5 3.17,24.29 3.17,29.84 27.15,29.84 28.26,30.96 28.42,30.96 IC6.7
ENC11  (via drill 0.61)
  Top 0.406: ST1.16 10.64,10.64 v10.64,23.97 | ST1.16
  Bottom 0.406: v10.64,23.97 13.97,27.3 27.15,27.3 28.26,28.42 28.42,28.42 IC6.6
GND  (via drill 0.61)
  Top 1.143: B1.- 89.22,74.14 91.12,72.23 91.12,64.61 92.87,62.87 93.82,62.87 U1.2 92.39,62.55 88.42,58.58 v88.42,56.52 | R3.1 | R3.1 ST3.2 ST3.4 | D1.A C4.- | D1.A | IC1.8 80.33,34.61 80.33,43.5 80.49,43.66 C3.- | IC1.8 | v84.93,22.86 84.93,30.64 D1.A | IC2.8 69.22,36.35 67.94,37.62 IC7.13 67.79,39.21 67.79,43.34 | IC2.8 | 67.79,43.34 67.79,46.2 IC7.4 | IC5.8 40.32,35.24 v40.32,35.4 | IC5.8 | v48.9,36.04 IC4.8 | IC4.8 | v58.74,36.04 58.74,33.81 58.9,33.66 IC3.8 | IC8.12 IC8.5 | IC8.12 | v65.25,36.35 65.25,38.58 IC7.12 | 18.18,66.75 15.88,69.06 C1.- | 18.18,66.75 19.21,65.72 19.21,56.83 19.53,56.52 BU6.49 | IC9.5 24.61,46.35 IC9.4 | IC9.5 | v24.92,33.66 24.77,33.81 v24.77,35.88 IC9.13 | IC9.12 IC9.5 | IC9.12 | C6.- 13.81,33.5 12.38,32.07 12.38,19.84 13.81,18.41 C5.- | v20.16,48.26 16.35,52.07 16.35,64.93 17.78,66.36 18.18,66.75 | 67.79,43.34 v68.26,43.34
  Bottom 1.143: C2.1 78.58,62.71 93.82,62.71 U1.2 | C2.1 | IC1.8 79.38,33.5 81.76,31.11 84.93,31.11 D1.A | C3.- 81.76,44.93 96.84,44.93 96.84,49.69 95.73,50.8 94.46,50.8 93.98,51.28 U2.2 93.66,51.91 91.12,51.91 91.12,53.82 v88.42,56.52 | C3.- | v84.93,22.86 91.92,22.86 ST3.4 | IC7.5 67.79,46.35 IC7.4 | IC7.5 | IC7.12 67.79,38.73 IC7.13 | IC7.12 | IC8.5 46.2,46.35 IC8.4 | IC8.5 | 40.4,35.48 43.5,38.58 43.66,38.58 IC8.12 44.29,38.73 46.2,38.73 IC8.13 46.67,38.26 v48.9,36.04 v58.74,36.04 59.21,36.35 v65.25,36.35 | 40.4,35.48 v40.32,35.4 | IC9.12 24.61,38.73 IC9.13 | IC9.12 | v24.92,33.66 28.42,33.66 IC6.8 | C5.- 13.81,18.41 7.62,24.61 6.99,24.61 ST1.2 6.51,24.77 ST1.1 | ST1.1 | C6.- 14.92,33.66 17.14,35.88 v24.77,35.88 25.24,36.04 39.85,36.04 40.4,35.48 | C6.- | v20.16,48.26 22.07,46.35 IC9.5 | v68.26,43.34 80.01,43.34 80.17,43.5 C3.-
N$4
  Bottom 0.406: R5.2 97.16,17.3 97.63,17.78 97.63,20.16 94.61,20.16 ST3.1 | R5.2
N$5
  Top 0.406: R4.2 94.46,13.34 93.34,14.45 93.34,21.59 94.46,22.7 ST3.3
N$6  (via drill 0.61)
  Top 0.406: R2.2 v89.53,24.29 | R2.2
  Bottom 0.406: v89.53,24.29 89.69,24.13 93.34,24.13 94.46,25.24 ST3.5
N$7  (via drill 0.61)
  Top 0.406: R1.2 88.42,14.76 88.42,25.4 v89.53,26.51 | R1.2
  Bottom 0.406: v89.53,26.51 89.69,26.67 93.34,26.67 94.46,27.78 ST3.7
N$8
  Top 0.406: BU6.35 40.01,59.05 40.01,65.72 46.51,72.23 54.45,72.23 JP1.2 | BU6.35
N$9
  Top 0.406: BU6.37 39.37,60.96 39.37,66.04 48.1,74.77 54.45,74.77 JP1.1 | BU6.37
SEL  (via drill 0.61)
  Top 0.406: v67.94,69.69 BU6.11 | v10.64,31.91 12.7,33.97 12.7,34.13 13.49,34.92 14.92,34.92 14.92,34.45 15.24,34.13 15.24,29.69 14.29,28.73 v14.29,26.19 | BU6.11
  Bottom 0.406: IC3.3 60.33,22.23 67.79,22.23 69.06,20.95 IC2.3 69.37,20.95 70.64,22.23 72.23,22.23 73.18,21.27 78.9,21.27 79.22,20.95 IC1.3 | IC3.3 | IC6.3 29.84,22.23 37.31,22.23 | 37.31,22.23 38.58,20.95 IC5.3 | IC6.3 | 37.31,22.23 47.47,22.23 48.74,20.95 IC4.3 49.05,20.95 50.32,22.23 51.91,22.23 53.18,20.95 58.9,20.95 IC3.3 | v67.94,69.69 66.52,71.12 53.34,71.12 50.16,74.3 3.97,74.3 1.59,71.91 1.59,31.91 v10.64,31.91 | v14.29,26.19 18.26,22.23 21.43,22.23 22.7,20.95 28.42,20.95 IC6.3
STATUS0  (via drill 0.61)
  Top 0.406: BU5.7 74.3,10.79 74.3,11.27 75.88,12.86 v75.88,22.38 | BU5.7
  Bottom 0.406: v75.88,22.38 78.26,24.77 83.98,24.77 87,27.78 91.92,27.78 ST3.8
STATUS1  (via drill 0.61)
  Top 0.406: v79.06,9.53 79.38,9.84 79.38,14.13 81.12,15.88 v81.12,20.95
  Bottom 0.406: BU5.6 76.83,9.53 v79.06,9.53 | v81.12,20.95 85.57,25.4 91.92,25.4 ST3.6 | BU5.6
VALVE0  (via drill 0.61)
  Top 0.406: v55.09,13.18 55.09,10.79 BU5.21 | v45.24,13.18 45.4,13.34 45.4,37.94 45.09,38.26 45.09,52.23 43.81,53.5 43.81,62.71 48.26,67.15 66.83,67.15 66.83,70.01 67.63,70.8 74.3,70.8 v74.3,51.12 | v78.9,46.51 v78.9,39.69
  Bottom 0.406: v45.24,13.18 v55.09,13.18 | v74.3,51.12 v78.9,46.51 | v78.9,39.69 77.95,38.73 IC7.16 | IC7.16
VALVE1  (via drill 0.61)
  Top 0.406: v60.33,5.56 57.78,8.1 BU5.20 | v73.18,5.56 74.3,6.67 74.3,8.73 73.5,9.53 71.91,9.53 71.91,10.16 71.75,10.32 71.75,12.06 71.91,12.22 71.91,13.97 70.48,15.4 70.48,21.43 69.69,22.23 67.94,22.23 67.94,23.97 68.74,24.77 70.33,24.77 70.33,25.4 70.48,25.56 70.48,29.05 71.28,29.84 73.03,29.84 IC7.15
  Bottom 0.406: v60.33,5.56 v73.18,5.56
VALVE2  (via drill 0.61)
  Top 0.406: v65.25,34.77 65.25,13.18 64.14,12.06 64.14,10.32 63.82,10 63.82,9.53 62.39,9.53 61.59,8.73 61.59,6.99 59.85,6.99 59.05,7.78 59.05,9.37 57.78,10.64 BU5.19 | v63.02,34.92 60.33,37.62 IC7.10
  Bottom 0.406: v65.25,34.77 65.09,34.92 v63.02,34.92
VALVE3
  Top 0.406: BU5.18 60.17,8.26 59.69,8.73 59.69,9.68 59.05,10.32 59.05,12.06 56.36,14.76 56.36,26.67 57.63,27.94 57.63,38.58 IC7.9
VALVE4  (via drill 0.61)
  Top 0.406: v57.47,22.07 57.47,14.61 59.69,12.38 59.69,11.27 60.17,10.79 BU5.17 | v53.5,23.65 53.82,23.97 53.82,38.58 IC8.16
  Bottom 0.406: v57.47,22.07 55.88,23.65 v53.5,23.65
VALVE5  (via drill 0.61)
  Top 0.406: v46.67,6.99 46.35,7.3 46.35,34.92 48.9,37.47 51.28,37.47 51.28,38.58 IC8.15
  Bottom 0.406: v46.67,6.99 61.59,6.99 62.71,8.1 BU5.16
VALVE6  (via drill 0.61)
  Top 0.406: v40.96,40.96 IC8.10 | v56.36,40.01 56.2,39.85 56.2,29.37 54.61,27.78 54.61,23.18 55.09,22.7 55.09,16.19 v54.61,15.72 | v60.33,13.18 62.71,10.79 BU5.15 | IC8.10
  Bottom 0.406: v40.96,40.96 41.91,40.01 v56.36,40.01 | v54.61,15.72 57.15,13.18 v60.33,13.18
VALVE7  (via drill 0.61)
  Top 0.406: v28.57,39.69 28.57,35.88 25.56,32.86 25.56,24.45 26.04,23.97 26.04,3.33 63.98,3.33 64.77,4.13 64.77,7.62 65.25,8.1 BU5.14
  Bottom 0.406: v28.57,39.69 28.89,40.01 34.77,40.01 36.04,38.73 IC8.9
VALVE8
  Top 0.406: IC9.16 32.38,38.58 33.97,36.99 33.97,20.64 33.5,20.16 33.5,11.43 33.66,11.27 33.66,7.62 36.83,4.45 64.14,4.45 64.14,8.89 65.25,10 65.25,10.64 BU5.13
VALVE9  (via drill 0.61)
  Top 0.406: v67.79,4.45 67.79,8.1 BU5.12 | v31.91,4.45 28.57,7.78 28.57,14.13 29.84,15.4 IC9.15
  Bottom 0.406: v31.91,4.45 v67.79,4.45
VALVE10  (via drill 0.61)
  Top 0.406: v16.51,12.06 17.14,12.7 IC9.10
  Bottom 0.406: v16.51,12.06 33.66,12.06 33.66,10.32 34.45,9.53 66.67,9.53 67.79,10.64 BU5.11
VALVE11  (via drill 0.61)
  Top 0.406: IC9.9 18.41,42.55 18.41,48.58 14.92,52.07 14.92,56.2 v14.76,56.36 | v97,53.98 97,14.92 95.89,13.81 95.89,12.86 v87.79,4.76 | v71.44,4.45 70.48,5.4 BU5.10 | IC9.9
  Bottom 0.406: v14.76,56.36 16.19,57.78 93.19,57.78 v97,53.98 | v87.79,4.76 87.47,4.45 v71.44,4.45
VIN
  Top 1.143: U2.1 96.84,56.83 96.84,63.66 95.25,65.25 93.98,65.25 U1.1 | U2.1 | C1.+ 63.98,69.22 63.98,74.14 B1.+ | C1.+
  Bottom 1.143: B1.+ 64.14,74.14 68.58,74.14 76.68,66.04 C2.2 77.31,65.72 93.5,65.72 93.82,65.41 U1.1

### Text on the board
Top: Hexapod Interface | kls 01/1999 | TOP
Bottom: BOT